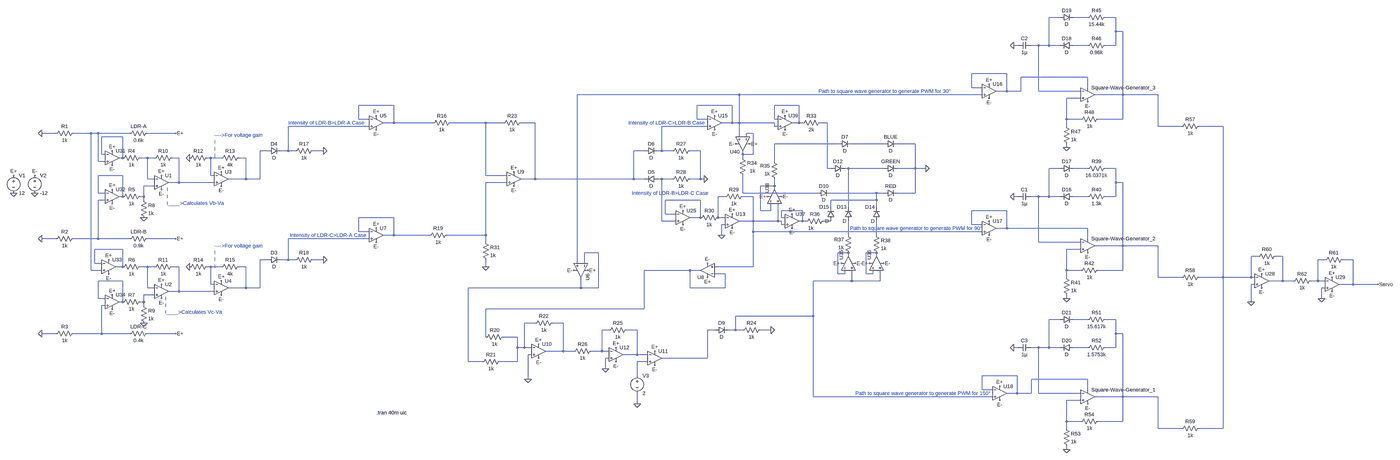
[diagram p0: schematic EE213_YunusCay_RafetKavak_CircuitSchematic.asc, whole sheet]
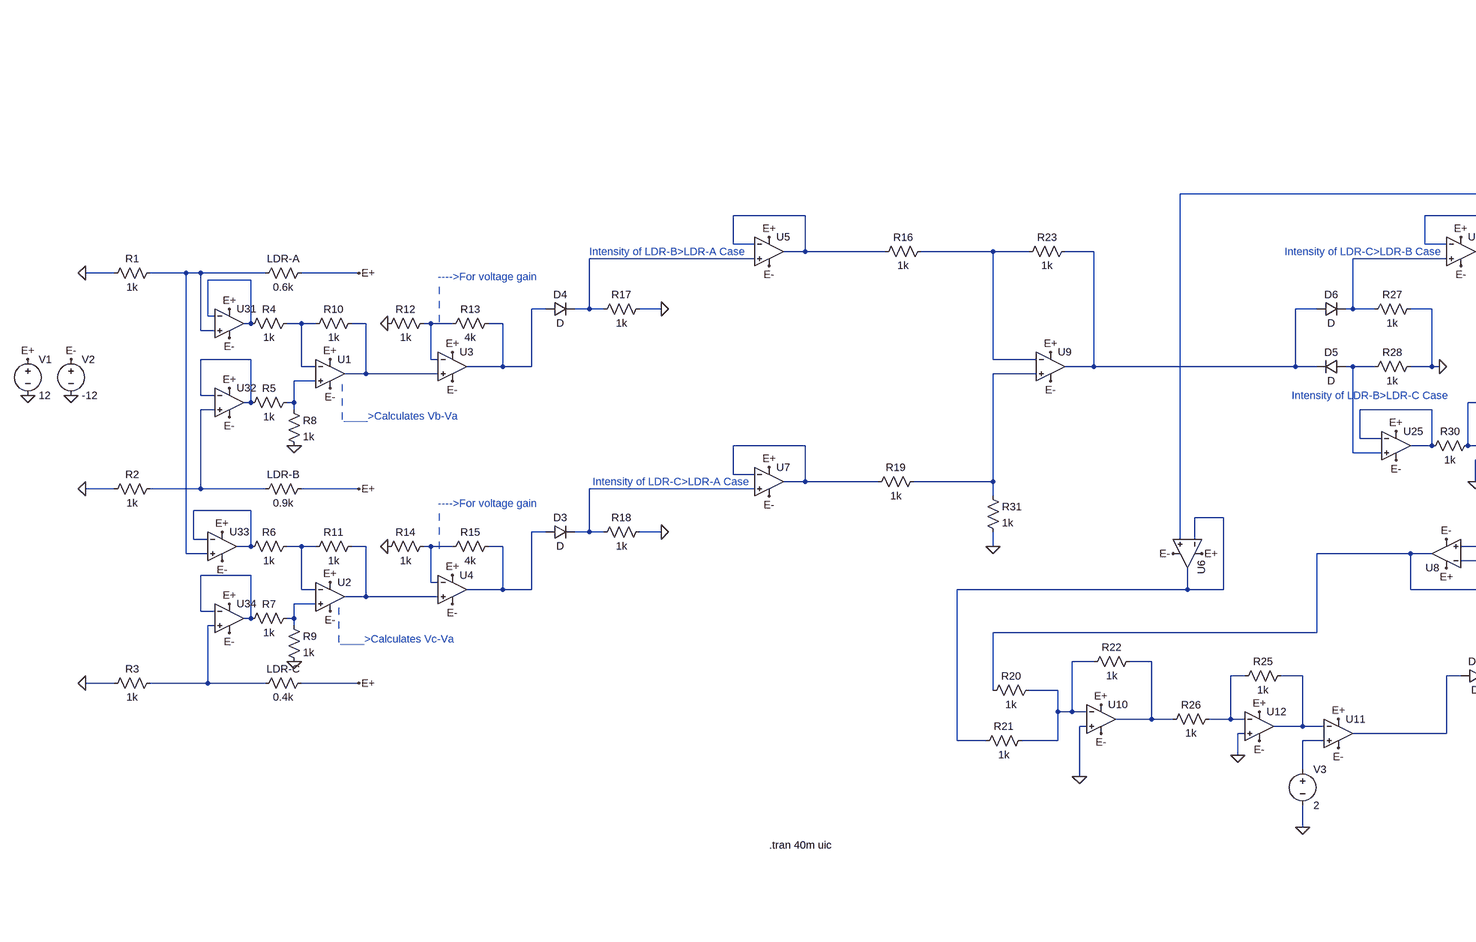
[diagram p1: schematic EE213_YunusCay_RafetKavak_CircuitSchematic.asc, part, row 1 of 1, column 1 of 2]
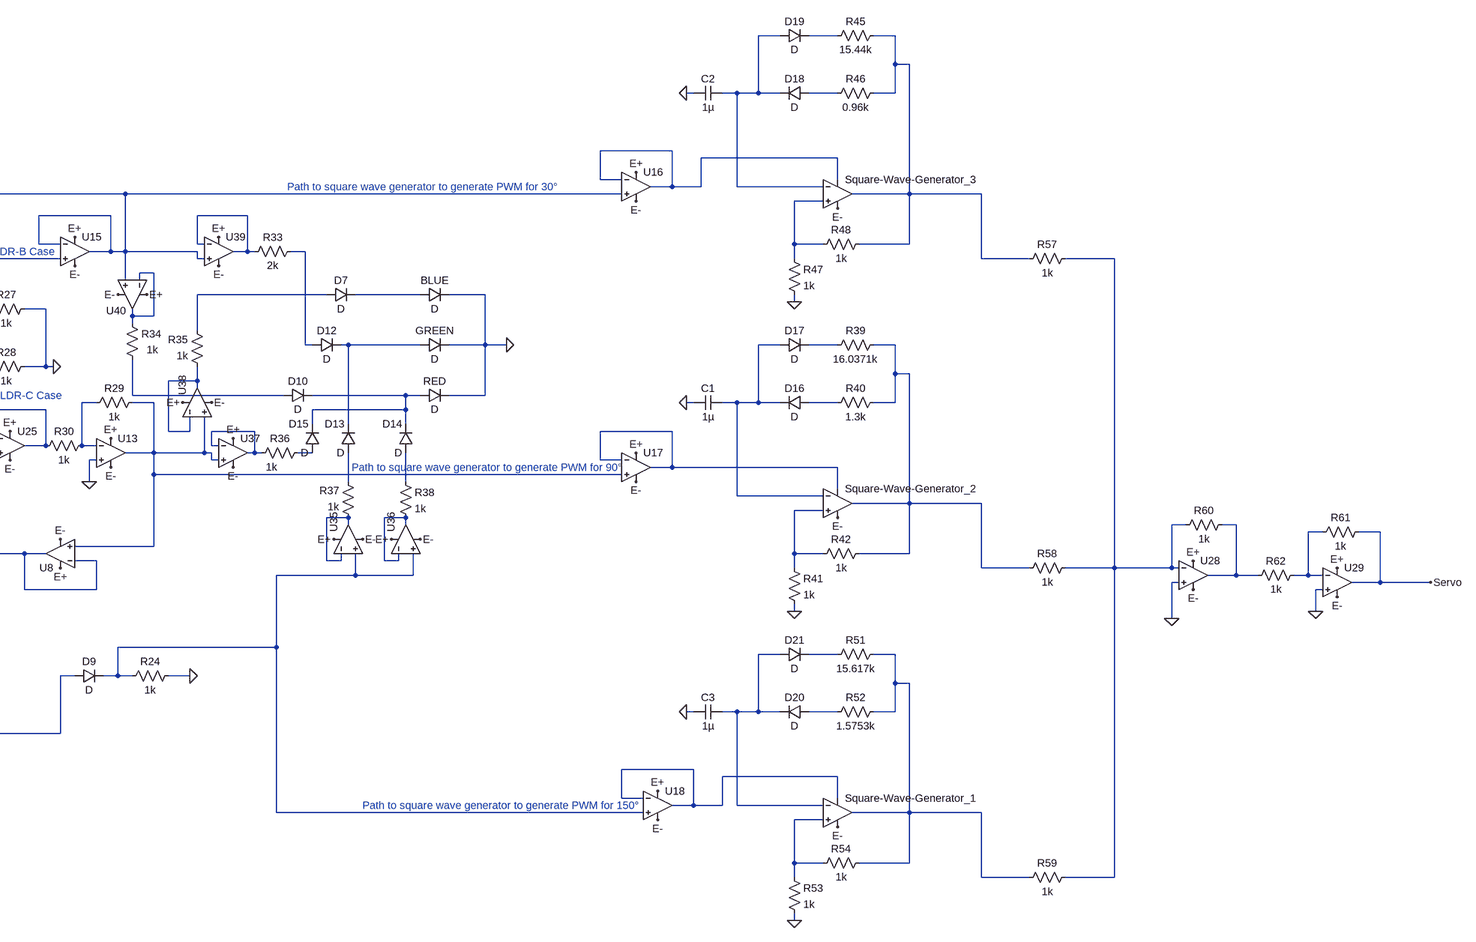
[diagram p2: schematic EE213_YunusCay_RafetKavak_CircuitSchematic.asc, part, row 1 of 1, column 2 of 2]
EE213_YunusCay_RafetKavak_CircuitSchematic.asc, the LTspice schematic file:
Version 4
SHEET 1 5364 1720
WIRE 1184 -288 1136 -288
WIRE 1312 -288 1248 -288
WIRE 1440 -288 1392 -288
WIRE 1440 -224 1440 -288
WIRE 1472 -224 1440 -224
WIRE 992 -160 976 -160
WIRE 1088 -160 1056 -160
WIRE 1136 -160 1136 -288
WIRE 1136 -160 1088 -160
WIRE 1184 -160 1136 -160
WIRE 1312 -160 1248 -160
WIRE 1440 -160 1440 -224
WIRE 1440 -160 1392 -160
WIRE 944 -32 784 -32
WIRE 1312 -16 1008 -16
WIRE 784 32 784 -32
WIRE 832 32 784 32
WIRE 1312 32 1312 -16
WIRE 944 48 944 -32
WIRE 944 48 896 48
WIRE 1008 48 1008 -16
WIRE 1008 48 944 48
WIRE 1088 48 1088 -160
WIRE 1280 48 1088 48
WIRE -272 64 -1008 64
WIRE 832 64 -272 64
WIRE 1472 64 1472 -224
WIRE 1472 64 1344 64
WIRE 1632 64 1472 64
WIRE 1280 80 1216 80
WIRE -1872 112 -2032 112
WIRE -304 112 -464 112
WIRE 0 112 -112 112
WIRE -2032 176 -2032 112
WIRE -1984 176 -2032 176
WIRE -464 176 -464 112
WIRE -416 176 -464 176
WIRE -112 176 -112 112
WIRE -96 176 -112 176
WIRE 1216 176 1216 80
WIRE 1280 176 1216 176
WIRE 1472 176 1472 64
WIRE 1472 176 1360 176
WIRE -1872 192 -1872 112
WIRE -1872 192 -1920 192
WIRE -1664 192 -1872 192
WIRE -1424 192 -1584 192
WIRE -1344 192 -1424 192
WIRE -1200 192 -1264 192
WIRE -304 192 -304 112
WIRE -304 192 -352 192
WIRE -272 192 -272 64
WIRE -272 192 -304 192
WIRE -112 192 -272 192
WIRE 0 192 0 112
WIRE 0 192 -32 192
WIRE 16 192 0 192
WIRE 128 192 96 192
WIRE -1984 208 -2352 208
WIRE -416 208 -624 208
WIRE -112 208 -112 192
WIRE -96 208 -112 208
WIRE 1216 208 1216 176
WIRE 1632 208 1632 64
WIRE 2240 208 1632 208
WIRE 2544 208 2320 208
WIRE -3408 240 -3472 240
WIRE -3248 240 -3328 240
WIRE -3216 240 -3248 240
WIRE -3072 240 -3216 240
WIRE -2864 240 -2992 240
WIRE -208 240 -240 240
WIRE -3104 256 -3200 256
WIRE -272 256 -272 192
WIRE -240 256 -240 240
WIRE 176 288 -112 288
WIRE 384 288 240 288
WIRE 528 288 448 288
WIRE 1216 304 1216 288
WIRE -2448 320 -2480 320
WIRE -2352 320 -2352 208
WIRE -2352 320 -2384 320
WIRE -2320 320 -2352 320
WIRE -2192 320 -2240 320
WIRE -704 320 -752 320
WIRE -624 320 -624 208
WIRE -624 320 -640 320
WIRE -576 320 -624 320
WIRE -448 320 -496 320
WIRE -3200 336 -3200 256
WIRE -3184 336 -3200 336
WIRE -256 336 -256 320
WIRE -208 336 -208 240
WIRE -208 336 -256 336
WIRE -3104 352 -3104 256
WIRE -3104 352 -3120 352
WIRE -2992 352 -3024 352
WIRE -2960 352 -2992 352
WIRE -2848 352 -2880 352
WIRE -2704 352 -2720 352
WIRE -2656 352 -2704 352
WIRE -2544 352 -2576 352
WIRE -256 352 -256 336
WIRE -3216 368 -3216 240
WIRE -3184 368 -3216 368
WIRE -112 368 -112 288
WIRE 128 400 128 192
WIRE 144 400 128 400
WIRE 224 400 208 400
WIRE 384 400 224 400
WIRE 528 400 528 288
WIRE 528 400 448 400
WIRE 576 400 528 400
WIRE 1184 400 1136 400
WIRE 1312 400 1248 400
WIRE 1440 400 1392 400
WIRE -3104 432 -3216 432
WIRE -2704 432 -2704 352
WIRE -2688 432 -2704 432
WIRE -1424 432 -1424 192
WIRE -1328 432 -1424 432
WIRE -2992 448 -2992 352
WIRE -2960 448 -2992 448
WIRE -2544 448 -2544 352
WIRE -2544 448 -2624 448
WIRE -2480 448 -2480 320
WIRE -2480 448 -2544 448
WIRE -1200 448 -1200 192
WIRE -1200 448 -1264 448
WIRE -752 448 -752 320
WIRE -752 448 -1200 448
WIRE -704 448 -752 448
WIRE -624 448 -640 448
WIRE -576 448 -624 448
WIRE -448 448 -448 320
WIRE -448 448 -496 448
WIRE -432 448 -448 448
WIRE -2848 464 -2848 352
WIRE -2848 464 -2896 464
WIRE -2688 464 -2848 464
WIRE -1328 464 -1424 464
WIRE 1440 464 1440 400
WIRE 1472 464 1440 464
WIRE -2960 480 -3008 480
WIRE -112 480 -112 448
WIRE -112 480 -176 480
WIRE -112 496 -112 480
WIRE -3216 512 -3216 432
WIRE -3184 512 -3216 512
WIRE -256 512 -256 432
WIRE 80 512 -256 512
WIRE 352 512 144 512
WIRE 384 512 352 512
WIRE 528 512 528 400
WIRE 528 512 448 512
WIRE -3104 528 -3104 432
WIRE -3104 528 -3120 528
WIRE -3008 528 -3008 480
WIRE -3008 528 -3024 528
WIRE -336 528 -368 528
WIRE -208 528 -256 528
WIRE 992 528 976 528
WIRE 1088 528 1056 528
WIRE 1136 528 1136 400
WIRE 1136 528 1088 528
WIRE 1184 528 1136 528
WIRE 1312 528 1248 528
WIRE 1440 528 1440 464
WIRE 1440 528 1392 528
WIRE -3184 544 -3216 544
WIRE -3008 544 -3008 528
WIRE -448 544 -608 544
WIRE 352 544 352 512
WIRE 352 544 144 544
WIRE 144 576 144 544
WIRE 224 576 224 400
WIRE 352 576 352 544
WIRE -176 592 -176 480
WIRE -128 592 -128 560
WIRE -128 592 -176 592
WIRE 16 592 -80 592
WIRE 944 592 784 592
WIRE -608 608 -608 544
WIRE -560 608 -608 608
WIRE -1872 624 -2032 624
WIRE -448 624 -448 544
WIRE -448 624 -496 624
WIRE -368 624 -368 528
WIRE -336 624 -368 624
WIRE -80 624 -80 592
WIRE -64 624 -80 624
WIRE -624 640 -624 448
WIRE -560 640 -624 640
WIRE -208 640 -208 528
WIRE -208 640 -272 640
WIRE -96 640 -96 560
WIRE -96 640 -208 640
WIRE -80 640 -96 640
WIRE 16 640 16 592
WIRE 16 640 0 640
WIRE 32 640 16 640
WIRE 144 640 112 640
WIRE -336 656 -352 656
WIRE -80 656 -80 640
WIRE -64 656 -80 656
WIRE 784 656 784 592
WIRE 832 656 784 656
WIRE 944 672 944 592
WIRE 944 672 896 672
WIRE 1312 672 944 672
WIRE -2032 688 -2032 624
WIRE -1984 688 -2032 688
WIRE -208 688 -208 640
WIRE 832 688 -208 688
WIRE -1872 704 -1872 624
WIRE -1872 704 -1920 704
WIRE -1680 704 -1872 704
WIRE -1424 704 -1424 464
WIRE -1424 704 -1600 704
WIRE -352 704 -352 656
WIRE 224 704 224 640
WIRE 352 704 352 640
WIRE -3408 720 -3472 720
WIRE -3216 720 -3216 544
WIRE -3216 720 -3328 720
WIRE -3072 720 -3216 720
WIRE -2864 720 -2992 720
WIRE -1984 720 -2352 720
WIRE 1312 720 1312 672
WIRE -1424 736 -1424 704
WIRE 1088 736 1088 528
WIRE 1280 736 1088 736
WIRE 1472 752 1472 464
WIRE 1472 752 1344 752
WIRE 1632 752 1472 752
WIRE -3104 768 -3232 768
WIRE 1280 768 1216 768
WIRE -912 784 -976 784
WIRE 224 784 176 784
WIRE 352 784 304 784
WIRE 224 800 224 784
WIRE 352 800 352 784
WIRE 2800 800 2768 800
WIRE 2912 800 2880 800
WIRE -2448 816 -2480 816
WIRE -2352 816 -2352 720
WIRE -2352 816 -2384 816
WIRE -2320 816 -2352 816
WIRE -2192 816 -2240 816
WIRE 3104 816 3072 816
WIRE 3232 816 3184 816
WIRE -3232 832 -3232 768
WIRE -3200 832 -3232 832
WIRE -1008 832 -1008 64
WIRE -976 832 -976 784
WIRE -3104 848 -3104 768
WIRE -3104 848 -3136 848
WIRE -2992 848 -3024 848
WIRE -2960 848 -2992 848
WIRE -2848 848 -2880 848
WIRE -2704 848 -2720 848
WIRE -2656 848 -2704 848
WIRE -2544 848 -2576 848
WIRE -1424 848 -1424 816
WIRE -208 848 -208 688
WIRE -208 848 -384 848
WIRE -3248 864 -3248 240
WIRE -3200 864 -3248 864
WIRE -496 864 -704 864
WIRE -448 864 -496 864
WIRE 1216 864 1216 768
WIRE 1280 864 1216 864
WIRE 1472 864 1472 752
WIRE 1472 864 1360 864
WIRE -336 880 -384 880
WIRE 176 880 176 784
WIRE 208 880 208 864
WIRE 208 880 176 880
WIRE 304 880 304 784
WIRE 336 880 336 864
WIRE 336 880 304 880
WIRE 1216 896 1216 864
WIRE 1632 896 1632 752
WIRE 2240 896 1632 896
WIRE 2544 896 2544 208
WIRE 2544 896 2320 896
WIRE 2768 896 2768 800
WIRE 2768 896 2544 896
WIRE 2784 896 2768 896
WIRE -3104 912 -3216 912
WIRE 240 912 240 864
WIRE 240 912 64 912
WIRE 368 912 368 864
WIRE 368 912 240 912
WIRE 2912 912 2912 800
WIRE 2912 912 2848 912
WIRE 2960 912 2912 912
WIRE 3072 912 3072 816
WIRE 3072 912 3040 912
WIRE 3104 912 3072 912
WIRE -2704 928 -2704 848
WIRE -2688 928 -2704 928
WIRE 2784 928 2768 928
WIRE 3232 928 3232 816
WIRE 3232 928 3168 928
WIRE 3392 928 3232 928
WIRE -2992 944 -2992 848
WIRE -2960 944 -2992 944
WIRE -2544 944 -2544 848
WIRE -2544 944 -2624 944
WIRE -2480 944 -2480 816
WIRE -2480 944 -2544 944
WIRE -992 944 -992 896
WIRE -992 944 -1504 944
WIRE -912 944 -912 784
WIRE -912 944 -992 944
WIRE -496 944 -496 864
WIRE -336 944 -336 880
WIRE -336 944 -496 944
WIRE 3104 944 3088 944
WIRE -2848 960 -2848 848
WIRE -2848 960 -2896 960
WIRE -2688 960 -2848 960
WIRE -2960 976 -3008 976
WIRE -3216 992 -3216 912
WIRE -3184 992 -3216 992
WIRE 1216 992 1216 976
WIRE 3088 992 3088 944
WIRE -3104 1008 -3104 912
WIRE -3104 1008 -3120 1008
WIRE -3008 1008 -3008 976
WIRE -3008 1008 -3024 1008
WIRE 2768 1008 2768 928
WIRE -3184 1024 -3200 1024
WIRE -3008 1024 -3008 1008
WIRE -704 1040 -704 864
WIRE -704 1040 -1424 1040
WIRE 64 1072 64 912
WIRE 64 1072 -288 1072
WIRE 1184 1088 1136 1088
WIRE 1312 1088 1248 1088
WIRE 1440 1088 1392 1088
WIRE -1200 1104 -1248 1104
WIRE -1072 1104 -1120 1104
WIRE -864 1136 -896 1136
WIRE -736 1136 -784 1136
WIRE -384 1136 -416 1136
WIRE -288 1136 -288 1072
WIRE -288 1136 -320 1136
WIRE -256 1136 -288 1136
WIRE -128 1136 -176 1136
WIRE -3408 1152 -3472 1152
WIRE -3200 1152 -3200 1024
WIRE -3200 1152 -3328 1152
WIRE -3072 1152 -3200 1152
WIRE -2864 1152 -2992 1152
WIRE 1440 1152 1440 1088
WIRE 1472 1152 1440 1152
WIRE -1424 1168 -1424 1040
WIRE -1280 1168 -1344 1168
WIRE -1280 1216 -1280 1168
WIRE -1248 1216 -1248 1104
WIRE -1248 1216 -1280 1216
WIRE -1216 1216 -1248 1216
WIRE 992 1216 976 1216
WIRE 1088 1216 1056 1216
WIRE 1136 1216 1136 1088
WIRE 1136 1216 1088 1216
WIRE 1184 1216 1136 1216
WIRE 1312 1216 1248 1216
WIRE 1440 1216 1440 1152
WIRE 1440 1216 1392 1216
WIRE -1072 1232 -1072 1104
WIRE -1072 1232 -1152 1232
WIRE -1024 1232 -1072 1232
WIRE -896 1232 -896 1136
WIRE -896 1232 -944 1232
WIRE -864 1232 -896 1232
WIRE -1216 1248 -1232 1248
WIRE -736 1248 -736 1136
WIRE -736 1248 -800 1248
WIRE -688 1248 -736 1248
WIRE -864 1264 -880 1264
WIRE -416 1264 -416 1136
WIRE -416 1264 -624 1264
WIRE -1504 1280 -1504 944
WIRE -1440 1280 -1504 1280
WIRE -1280 1280 -1280 1216
WIRE -1280 1280 -1360 1280
WIRE -688 1280 -736 1280
WIRE -880 1312 -880 1264
WIRE -736 1344 -736 1280
WIRE 992 1344 832 1344
WIRE -1232 1360 -1232 1248
WIRE 1312 1360 1056 1360
WIRE 832 1408 832 1344
WIRE 880 1408 832 1408
WIRE 1312 1408 1312 1360
WIRE 992 1424 992 1344
WIRE 992 1424 944 1424
WIRE 1056 1424 1056 1360
WIRE 1056 1424 992 1424
WIRE 1088 1424 1088 1216
WIRE 1280 1424 1088 1424
WIRE 64 1440 64 1072
WIRE 880 1440 64 1440
WIRE 1472 1440 1472 1152
WIRE 1472 1440 1344 1440
WIRE 1632 1440 1472 1440
WIRE 1280 1456 1216 1456
WIRE -736 1472 -736 1424
WIRE 1216 1552 1216 1456
WIRE 1280 1552 1216 1552
WIRE 1472 1552 1472 1440
WIRE 1472 1552 1360 1552
WIRE 1216 1584 1216 1552
WIRE 1632 1584 1632 1440
WIRE 2240 1584 1632 1584
WIRE 2544 1584 2544 896
WIRE 2544 1584 2320 1584
WIRE 1216 1680 1216 1664
FLAG -3472 240 0
FLAG -3472 720 0
FLAG -3472 1152 0
FLAG -3600 512 0
FLAG -3504 512 0
FLAG -3600 432 E+
FLAG -3504 432 E-
FLAG -3008 624 0
FLAG -3008 1104 0
FLAG -2800 352 0
FLAG -2800 848 0
FLAG -2192 320 0
FLAG -2192 816 0
FLAG -352 704 0
FLAG -432 448 0
FLAG 576 400 0
FLAG 976 528 0
FLAG 1216 992 0
FLAG 976 -160 0
FLAG 1216 304 0
FLAG 976 1216 0
FLAG 1216 1680 0
FLAG 2768 1008 0
FLAG 3088 992 0
FLAG -2928 432 E+
FLAG -2656 416 E+
FLAG -2928 928 E+
FLAG -2656 912 E+
FLAG -1952 672 E+
FLAG -1952 160 E+
FLAG -1296 416 E+
FLAG -304 608 E+
FLAG -384 160 E+
FLAG 864 16 E+
FLAG 864 640 E+
FLAG 912 1392 E+
FLAG 3136 896 E+
FLAG 2816 880 E+
FLAG 3136 960 E-
FLAG 2816 944 E-
FLAG 912 1456 E-
FLAG 864 704 E-
FLAG 864 80 E-
FLAG -304 672 E-
FLAG -384 224 E-
FLAG -1296 480 E-
FLAG -1952 736 E-
FLAG -1952 224 E-
FLAG -2656 480 E-
FLAG -2928 496 E-
FLAG -2656 976 E-
FLAG -2928 992 E-
FLAG -2864 240 E+
FLAG -2864 720 E+
FLAG -2864 1152 E+
FLAG 3392 928 Servo
FLAG -528 592 E+
FLAG -528 656 E-
FLAG -64 160 E+
FLAG -224 288 E+
FLAG -144 528 E+
FLAG -32 608 E+
FLAG 320 832 E+
FLAG 192 832 E+
FLAG -288 288 E-
FLAG -32 672 E-
FLAG -80 528 E-
FLAG -64 224 E-
FLAG 256 832 E-
FLAG 384 832 E-
FLAG -3152 320 E+
FLAG -3152 496 E+
FLAG -3168 816 E+
FLAG -3152 976 E+
FLAG -3152 384 E-
FLAG -3152 560 E-
FLAG -3168 880 E-
FLAG -3152 1040 E-
FLAG -960 864 E+
FLAG -1024 864 E-
FLAG -416 896 E+
FLAG -416 832 E-
FLAG -1184 1200 E+
FLAG -1184 1264 E-
FLAG -1232 1360 0
FLAG -128 1136 0
FLAG -656 1232 E+
FLAG -656 1296 E-
FLAG -736 1472 0
FLAG -880 1312 0
FLAG -832 1216 E+
FLAG -832 1280 E-
FLAG -1424 848 0
FLAG 1312 96 E-
FLAG 1312 784 E-
FLAG 1312 1472 E-
SYMBOL res -3312 224 R90
WINDOW 0 0 56 VBottom 2
WINDOW 3 32 56 VTop 2
SYMATTR InstName R1
SYMATTR Value 1k
SYMBOL res -3312 704 R90
WINDOW 0 0 56 VBottom 2
WINDOW 3 32 56 VTop 2
SYMATTR InstName R2
SYMATTR Value 1k
SYMBOL res -3312 1136 R90
WINDOW 0 0 56 VBottom 2
WINDOW 3 32 56 VTop 2
SYMATTR InstName R3
SYMATTR Value 1k
SYMBOL voltage -3600 416 R0
WINDOW 123 0 0 Left 2
WINDOW 39 0 0 Left 2
SYMATTR InstName V1
SYMATTR Value 12
SYMBOL voltage -3504 416 R0
WINDOW 123 0 0 Left 2
WINDOW 39 0 0 Left 2
SYMATTR InstName V2
SYMATTR Value -12
SYMBOL res -3008 336 R90
WINDOW 0 0 56 VBottom 2
WINDOW 3 32 56 VTop 2
SYMATTR InstName R4
SYMATTR Value 1k
SYMBOL res -3008 512 R90
WINDOW 0 0 56 VBottom 2
WINDOW 3 32 56 VTop 2
SYMATTR InstName R5
SYMATTR Value 1k
SYMBOL res -3008 832 R90
WINDOW 0 0 56 VBottom 2
WINDOW 3 32 56 VTop 2
SYMATTR InstName R6
SYMATTR Value 1k
SYMBOL res -3008 992 R90
WINDOW 0 0 56 VBottom 2
WINDOW 3 32 56 VTop 2
SYMATTR InstName R7
SYMATTR Value 1k
SYMBOL res -3024 528 R0
SYMATTR InstName R8
SYMATTR Value 1k
SYMBOL res -3024 1008 R0
SYMATTR InstName R9
SYMATTR Value 1k
SYMBOL res -2864 336 R90
WINDOW 0 0 56 VBottom 2
WINDOW 3 32 56 VTop 2
SYMATTR InstName R10
SYMATTR Value 1k
SYMBOL res -2864 832 R90
WINDOW 0 0 56 VBottom 2
WINDOW 3 32 56 VTop 2
SYMATTR InstName R11
SYMATTR Value 1k
SYMBOL Opamps\\UniversalOpamp2 -2928 464 R0
SYMATTR InstName U1
SYMBOL Opamps\\UniversalOpamp2 -2928 960 R0
SYMATTR InstName U2
SYMBOL Opamps\\UniversalOpamp2 -2656 448 R0
SYMATTR InstName U3
SYMBOL Opamps\\UniversalOpamp2 -2656 944 R0
SYMATTR InstName U4
SYMBOL res -2704 336 R90
WINDOW 0 0 56 VBottom 2
WINDOW 3 32 56 VTop 2
SYMATTR InstName R12
SYMATTR Value 1k
SYMBOL res -2560 336 R90
WINDOW 0 0 56 VBottom 2
WINDOW 3 32 56 VTop 2
SYMATTR InstName R13
SYMATTR Value 4k
SYMBOL res -2704 832 R90
WINDOW 0 0 56 VBottom 2
WINDOW 3 32 56 VTop 2
SYMATTR InstName R14
SYMATTR Value 1k
SYMBOL res -2560 832 R90
WINDOW 0 0 56 VBottom 2
WINDOW 3 32 56 VTop 2
SYMATTR InstName R15
SYMATTR Value 4k
SYMBOL diode -2448 832 R270
WINDOW 0 32 32 VTop 2
WINDOW 3 0 32 VBottom 2
SYMATTR InstName D3
SYMBOL diode -2448 336 R270
WINDOW 0 32 32 VTop 2
WINDOW 3 0 32 VBottom 2
SYMATTR InstName D4
SYMBOL res -2224 304 R90
WINDOW 0 0 56 VBottom 2
WINDOW 3 32 56 VTop 2
SYMATTR InstName R17
SYMATTR Value 1k
SYMBOL res -2224 800 R90
WINDOW 0 0 56 VBottom 2
WINDOW 3 32 56 VTop 2
SYMATTR InstName R18
SYMATTR Value 1k
SYMBOL Opamps\\UniversalOpamp2 -1952 192 R0
SYMATTR InstName U5
SYMBOL Opamps\\UniversalOpamp2 -1952 704 R0
SYMATTR InstName U7
SYMBOL Opamps\\UniversalOpamp2 -1296 448 R0
SYMATTR InstName U9
SYMBOL diode -640 432 R90
WINDOW 0 0 32 VBottom 2
WINDOW 3 32 32 VTop 2
SYMATTR InstName D5
SYMBOL diode -704 336 R270
WINDOW 0 32 32 VTop 2
WINDOW 3 0 32 VBottom 2
SYMATTR InstName D6
SYMBOL res -592 336 R270
WINDOW 0 32 56 VTop 2
WINDOW 3 0 56 VBottom 2
SYMATTR InstName R27
SYMATTR Value 1k
SYMBOL res -592 464 R270
WINDOW 0 32 56 VTop 2
WINDOW 3 0 56 VBottom 2
SYMATTR InstName R28
SYMATTR Value 1k
SYMBOL Opamps\\UniversalOpamp2 -304 640 R0
SYMATTR InstName U13
SYMBOL res -240 512 R90
WINDOW 0 0 56 VBottom 2
WINDOW 3 32 56 VTop 2
SYMATTR InstName R29
SYMATTR Value 1k
SYMBOL res -352 608 R90
WINDOW 0 0 56 VBottom 2
WINDOW 3 32 56 VTop 2
SYMATTR InstName R30
SYMATTR Value 1k
SYMBOL Opamps\\UniversalOpamp2 -384 192 R0
SYMATTR InstName U15
SYMBOL diode 384 304 R270
WINDOW 0 32 32 VTop 2
WINDOW 3 0 32 VBottom 2
SYMATTR InstName BLUE
SYMBOL diode 384 416 R270
WINDOW 0 32 32 VTop 2
WINDOW 3 0 32 VBottom 2
SYMATTR InstName GREEN
SYMBOL diode 384 528 R270
WINDOW 0 32 32 VTop 2
WINDOW 3 0 32 VBottom 2
SYMATTR InstName RED
SYMBOL res 112 176 R90
WINDOW 0 0 56 VBottom 2
WINDOW 3 32 56 VTop 2
SYMATTR InstName R33
SYMATTR Value 2k
SYMBOL res -272 336 R0
WINDOW 3 48 75 Left 2
SYMATTR Value 1k
SYMATTR InstName R34
SYMBOL res -96 464 R180
WINDOW 0 36 76 Left 2
WINDOW 3 36 40 Left 2
SYMATTR InstName R35
SYMATTR Value 1k
SYMBOL res 128 624 R90
WINDOW 0 0 56 VBottom 2
WINDOW 3 32 74 VTop 2
SYMATTR InstName R36
SYMATTR Value 1k
SYMBOL res 240 800 R180
WINDOW 0 36 76 Left 2
WINDOW 3 36 40 Left 2
SYMATTR InstName R37
SYMATTR Value 1k
SYMBOL res 336 688 R0
SYMATTR InstName R38
SYMATTR Value 1k
SYMBOL diode 80 528 R270
WINDOW 0 32 32 VTop 2
WINDOW 3 0 32 VBottom 2
SYMATTR InstName D10
SYMBOL diode 144 416 R270
WINDOW 0 32 32 VTop 2
WINDOW 3 0 32 VBottom 2
SYMATTR InstName D12
SYMBOL diode 240 640 R180
WINDOW 0 24 64 Left 2
WINDOW 3 24 0 Left 2
SYMATTR InstName D13
SYMBOL diode 368 640 R180
WINDOW 0 24 64 Left 2
WINDOW 3 24 0 Left 2
SYMATTR InstName D14
SYMBOL diode 160 640 R180
WINDOW 0 24 64 Left 2
WINDOW 3 24 0 Left 2
SYMATTR InstName D15
SYMBOL Opamps\\UniversalOpamp2 864 48 R0
SYMATTR InstName U16
SYMBOL Opamps\\UniversalOpamp2 864 672 R0
SYMATTR InstName U17
SYMBOL Opamps\\UniversalOpamp2 912 1424 R0
SYMATTR InstName U18
SYMBOL Opamps\\UniversalOpamp2 1312 1440 R0
SYMATTR InstName Square-Wave-Generator_1
SYMBOL cap 1056 512 R90
WINDOW 0 0 32 VBottom 2
WINDOW 3 32 32 VTop 2
SYMATTR InstName C1
SYMATTR Value 1µ
SYMBOL diode 1248 512 R90
WINDOW 0 0 32 VBottom 2
WINDOW 3 32 32 VTop 2
SYMATTR InstName D16
SYMBOL diode 1184 416 R270
WINDOW 0 32 32 VTop 2
WINDOW 3 0 32 VBottom 2
SYMATTR InstName D17
SYMBOL res 1296 416 R270
WINDOW 0 32 56 VTop 2
WINDOW 3 0 56 VBottom 2
SYMATTR InstName R39
SYMATTR Value 16.0371k
SYMBOL res 1296 544 R270
WINDOW 0 32 56 VTop 2
WINDOW 3 0 56 VBottom 2
SYMATTR InstName R40
SYMATTR Value 1.3k
SYMBOL res 1200 880 R0
SYMATTR InstName R41
SYMATTR Value 1k
SYMBOL res 1376 848 R90
WINDOW 0 0 56 VBottom 2
WINDOW 3 32 56 VTop 2
SYMATTR InstName R42
SYMATTR Value 1k
SYMBOL Opamps\\UniversalOpamp2 1312 752 R0
SYMATTR InstName Square-Wave-Generator_2
SYMBOL cap 1056 -176 R90
WINDOW 0 0 32 VBottom 2
WINDOW 3 32 32 VTop 2
SYMATTR InstName C2
SYMATTR Value 1µ
SYMBOL diode 1248 -176 R90
WINDOW 0 0 32 VBottom 2
WINDOW 3 32 32 VTop 2
SYMATTR InstName D18
SYMBOL diode 1184 -272 R270
WINDOW 0 32 32 VTop 2
WINDOW 3 0 32 VBottom 2
SYMATTR InstName D19
SYMBOL res 1296 -272 R270
WINDOW 0 32 56 VTop 2
WINDOW 3 0 56 VBottom 2
SYMATTR InstName R45
SYMATTR Value 15.44k
SYMBOL res 1296 -144 R270
WINDOW 0 32 56 VTop 2
WINDOW 3 0 56 VBottom 2
SYMATTR InstName R46
SYMATTR Value 0.96k
SYMBOL res 1200 192 R0
SYMATTR InstName R47
SYMATTR Value 1k
SYMBOL res 1376 160 R90
WINDOW 0 0 56 VBottom 2
WINDOW 3 32 56 VTop 2
SYMATTR InstName R48
SYMATTR Value 1k
SYMBOL Opamps\\UniversalOpamp2 1312 64 R0
SYMATTR InstName Square-Wave-Generator_3
SYMBOL cap 1056 1200 R90
WINDOW 0 0 32 VBottom 2
WINDOW 3 32 32 VTop 2
SYMATTR InstName C3
SYMATTR Value 1µ
SYMBOL diode 1248 1200 R90
WINDOW 0 0 32 VBottom 2
WINDOW 3 32 32 VTop 2
SYMATTR InstName D20
SYMBOL diode 1184 1104 R270
WINDOW 0 32 32 VTop 2
WINDOW 3 0 32 VBottom 2
SYMATTR InstName D21
SYMBOL res 1296 1104 R270
WINDOW 0 32 56 VTop 2
WINDOW 3 0 56 VBottom 2
SYMATTR InstName R51
SYMATTR Value 15.617k
SYMBOL res 1296 1232 R270
WINDOW 0 32 56 VTop 2
WINDOW 3 0 56 VBottom 2
SYMATTR InstName R52
SYMATTR Value 1.5753k
SYMBOL res 1200 1568 R0
SYMATTR InstName R53
SYMATTR Value 1k
SYMBOL res 1376 1536 R90
WINDOW 0 0 56 VBottom 2
WINDOW 3 32 56 VTop 2
SYMATTR InstName R54
SYMATTR Value 1k
SYMBOL res 2336 192 R90
WINDOW 0 0 56 VBottom 2
WINDOW 3 32 56 VTop 2
SYMATTR InstName R57
SYMATTR Value 1k
SYMBOL res 2336 880 R90
WINDOW 0 0 56 VBottom 2
WINDOW 3 32 56 VTop 2
SYMATTR InstName R58
SYMATTR Value 1k
SYMBOL res 2336 1568 R90
WINDOW 0 0 56 VBottom 2
WINDOW 3 32 56 VTop 2
SYMATTR InstName R59
SYMATTR Value 1k
SYMBOL Opamps\\UniversalOpamp2 2816 912 R0
SYMATTR InstName U28
SYMBOL res 2896 784 R90
WINDOW 0 0 56 VBottom 2
WINDOW 3 32 56 VTop 2
SYMATTR InstName R60
SYMATTR Value 1k
SYMBOL Opamps\\UniversalOpamp2 3136 928 R0
SYMATTR InstName U29
SYMBOL res 3200 800 R90
WINDOW 0 0 56 VBottom 2
WINDOW 3 32 56 VTop 2
SYMATTR InstName R61
SYMATTR Value 1k
SYMBOL res 3056 896 R90
WINDOW 0 0 56 VBottom 2
WINDOW 3 32 56 VTop 2
SYMATTR InstName R62
SYMATTR Value 1k
SYMBOL res -2976 224 R90
WINDOW 0 0 56 VBottom 2
WINDOW 3 32 56 VTop 2
SYMATTR InstName LDR-A
SYMATTR Value 0.6k
SYMBOL res -2976 704 R90
WINDOW 0 0 56 VBottom 2
WINDOW 3 32 56 VTop 2
SYMATTR InstName LDR-B
SYMATTR Value 0.9k
SYMBOL res -2976 1136 R90
WINDOW 0 0 56 VBottom 2
WINDOW 3 32 56 VTop 2
SYMATTR InstName LDR-C
SYMATTR Value 0.4k
SYMBOL Opamps\\UniversalOpamp2 -528 624 R0
SYMATTR InstName U25
SYMBOL diode 176 304 R270
WINDOW 0 32 32 VTop 2
WINDOW 3 0 32 VBottom 2
SYMATTR InstName D7
SYMBOL Opamps\\UniversalOpamp2 -3152 528 R0
SYMATTR InstName U32
SYMBOL Opamps\\UniversalOpamp2 -3152 352 R0
SYMATTR InstName U31
SYMBOL Opamps\\UniversalOpamp2 -3168 848 R0
SYMATTR InstName U33
SYMBOL Opamps\\UniversalOpamp2 -3152 1008 R0
SYMATTR InstName U34
SYMBOL Opamps\\UniversalOpamp2 224 832 R270
SYMATTR InstName U35
SYMBOL Opamps\\UniversalOpamp2 352 832 R270
SYMATTR InstName U36
SYMBOL Opamps\\UniversalOpamp2 -32 640 R0
SYMATTR InstName U37
SYMBOL Opamps\\UniversalOpamp2 -112 528 R270
SYMATTR InstName U38
SYMBOL Opamps\\UniversalOpamp2 -64 192 R0
SYMATTR InstName U39
SYMBOL Opamps\\UniversalOpamp2 -256 288 R90
WINDOW 0 36 14 VRight 2
SYMATTR InstName U40
SYMBOL Opamps\\UniversalOpamp2 -992 864 R90
SYMATTR InstName U6
SYMBOL Opamps\\UniversalOpamp2 -416 864 R180
SYMATTR InstName U8
SYMBOL Opamps\\UniversalOpamp2 -1184 1232 R0
SYMATTR InstName U10
SYMBOL res -1328 1152 R90
WINDOW 0 0 56 VBottom 2
WINDOW 3 32 56 VTop 2
SYMATTR InstName R20
SYMATTR Value 1k
SYMBOL res -1344 1264 R90
WINDOW 0 0 56 VBottom 2
WINDOW 3 32 56 VTop 2
SYMATTR InstName R21
SYMATTR Value 1k
SYMBOL res -1104 1088 R90
WINDOW 0 0 56 VBottom 2
WINDOW 3 32 56 VTop 2
SYMATTR InstName R22
SYMATTR Value 1k
SYMBOL diode -384 1152 R270
WINDOW 0 32 32 VTop 2
WINDOW 3 0 32 VBottom 2
SYMATTR InstName D9
SYMBOL res -160 1120 R90
WINDOW 0 0 56 VBottom 2
WINDOW 3 32 56 VTop 2
SYMATTR InstName R24
SYMATTR Value 1k
SYMBOL Opamps\\UniversalOpamp2 -656 1264 R0
SYMATTR InstName U11
SYMBOL voltage -736 1328 R0
WINDOW 123 0 0 Left 2
WINDOW 39 0 0 Left 2
SYMATTR InstName V3
SYMATTR Value 2
SYMBOL Opamps\\UniversalOpamp2 -832 1248 R0
SYMATTR InstName U12
SYMBOL res -768 1120 R90
WINDOW 0 0 56 VBottom 2
WINDOW 3 32 56 VTop 2
SYMATTR InstName R25
SYMATTR Value 1k
SYMBOL res -928 1216 R90
WINDOW 0 0 56 VBottom 2
WINDOW 3 32 56 VTop 2
SYMATTR InstName R26
SYMATTR Value 1k
SYMBOL res -1568 176 R90
WINDOW 0 0 56 VBottom 2
WINDOW 3 32 56 VTop 2
SYMATTR InstName R16
SYMATTR Value 1k
SYMBOL res -1584 688 R90
WINDOW 0 0 56 VBottom 2
WINDOW 3 32 56 VTop 2
SYMATTR InstName R19
SYMATTR Value 1k
SYMBOL res -1248 176 R90
WINDOW 0 0 56 VBottom 2
WINDOW 3 32 56 VTop 2
SYMATTR InstName R23
SYMATTR Value 1k
SYMBOL res -1440 720 R0
SYMATTR InstName R31
SYMATTR Value 1k
TEXT -1952 1512 Left 2 !.tran 40m uic
TEXT -2352 192 Left 2 ;Intensity of LDR-B>LDR-A Case
TEXT -2344 704 Left 2 ;Intensity of LDR-C>LDR-A Case
TEXT -2904 496 Left 2 ;I\nI\nI____>Calculates Vb-Va
TEXT -2912 992 Left 2 ;I\nI\nI____>Calculates Vc-Va
TEXT -2688 248 Left 2 ;---->For voltage gain\nI\nI\nI
TEXT -2688 752 Left 2 ;---->For voltage gain\nI\nI\nI
TEXT -776 192 Left 2 ;Intensity of LDR-C>LDR-B Case
TEXT -760 512 Left 2 ;Intensity of LDR-B>LDR-C Case
TEXT 88 48 Left 2 ;Path to square wave generator to generate PWM for 30°
TEXT 232 672 Left 2 ;Path to square wave generator to generate PWM for 90°
TEXT 256 1424 Left 2 ;Path to square wave generator to generate PWM for 150°

The netlist it stands for:
* EE213_YunusCay_RafetKavak_CircuitSchematic.asc
R1 N016 0 1k
R2 N039 0 1k
R3 N063 0 1k
V1 E+ 0 12
V2 E- 0 -12
R4 N022 N018 1k
R5 N032 N029 1k
R6 N056 N048 1k
R7 N062 N060 1k
R8 N032 0 1k
R9 N062 0 1k
R10 N023 N022 1k
R11 N057 N056 1k
XU1 N032 N022 E+ E- N023 level.2 Avol=1Meg GBW=10Meg Slew=10Meg ilimit=25m rail=0 Vos=0 phimargin=45 en=0 enk=0 in=0 ink=0 Rin=500Meg  ; pins IN+ IN- V+ V- OUT
XU2 N062 N056 E+ E- N057 level.2 Avol=1Meg GBW=10Meg Slew=10Meg ilimit=25m rail=0 Vos=0 phimargin=45 en=0 enk=0 in=0 ink=0 Rin=500Meg  ; pins IN+ IN- V+ V- OUT
XU3 N023 N024 E+ E- N021 level.2 Avol=1Meg GBW=10Meg Slew=10Meg ilimit=25m rail=0 Vos=0 phimargin=45 en=0 enk=0 in=0 ink=0 Rin=500Meg  ; pins IN+ IN- V+ V- OUT
XU4 N057 N058 E+ E- N054 level.2 Avol=1Meg GBW=10Meg Slew=10Meg ilimit=25m rail=0 Vos=0 phimargin=45 en=0 enk=0 in=0 ink=0 Rin=500Meg  ; pins IN+ IN- V+ V- OUT
R12 N024 0 1k
R13 N021 N024 4k
R14 N058 0 1k
R15 N054 N058 4k
D3 N054 N047 D
D4 N021 N013 D
R17 0 N013 1k
R18 0 N047 1k
XU5 N013 N008 E+ E- N008 level.2 Avol=1Meg GBW=10Meg Slew=10Meg ilimit=25m rail=0 Vos=0 phimargin=45 en=0 enk=0 in=0 ink=0 Rin=500Meg  ; pins IN+ IN- V+ V- OUT
XU7 N047 N043 E+ E- N043 level.2 Avol=1Meg GBW=10Meg Slew=10Meg ilimit=25m rail=0 Vos=0 phimargin=45 en=0 enk=0 in=0 ink=0 Rin=500Meg  ; pins IN+ IN- V+ V- OUT
XU9 N031 N010 E+ E- N011 level.2 Avol=1Meg GBW=10Meg Slew=10Meg ilimit=25m rail=0 Vos=0 phimargin=45 en=0 enk=0 in=0 ink=0 Rin=500Meg  ; pins IN+ IN- V+ V- OUT
D5 N030 N011 D
D6 N011 N014 D
R27 N014 0 1k
R28 N030 0 1k
XU13 0 N036 E+ E- N037 level.2 Avol=1Meg GBW=10Meg Slew=10Meg ilimit=25m rail=0 Vos=0 phimargin=45 en=0 enk=0 in=0 ink=0 Rin=500Meg  ; pins IN+ IN- V+ V- OUT
R29 N037 N036 1k
R30 N036 N040 1k
XU15 N014 N006 E+ E- N006 level.2 Avol=1Meg GBW=10Meg Slew=10Meg ilimit=25m rail=0 Vos=0 phimargin=45 en=0 enk=0 in=0 ink=0 Rin=500Meg  ; pins IN+ IN- V+ V- OUT
D§BLUE N020 0 D
D§GREEN N025 0 D
D§RED N035 0 D
R33 N012 N009 2k
R34 N017 N034 1k
R35 N033 N019 1k
R36 N044 N041 1k
R37 N051 N045 1k
R38 N046 N052 1k
D10 N034 N035 D
D12 N012 N025 D
D13 N045 N025 D
D14 N046 N035 D
D15 N044 N035 D
XU16 N006 N005 E+ E- N005 level.2 Avol=1Meg GBW=10Meg Slew=10Meg ilimit=25m rail=0 Vos=0 phimargin=45 en=0 enk=0 in=0 ink=0 Rin=500Meg  ; pins IN+ IN- V+ V- OUT
XU17 N037 N042 E+ E- N042 level.2 Avol=1Meg GBW=10Meg Slew=10Meg ilimit=25m rail=0 Vos=0 phimargin=45 en=0 enk=0 in=0 ink=0 Rin=500Meg  ; pins IN+ IN- V+ V- OUT
XU18 N061 N074 E+ E- N074 level.2 Avol=1Meg GBW=10Meg Slew=10Meg ilimit=25m rail=0 Vos=0 phimargin=45 en=0 enk=0 in=0 ink=0 Rin=500Meg  ; pins IN+ IN- V+ V- OUT
XSquare-Wave-Generator_1 N075 N064 N074 E- N066 level.2 Avol=1Meg GBW=10Meg Slew=10Meg ilimit=25m rail=0 Vos=0 phimargin=45 en=0 enk=0 in=0 ink=0 Rin=500Meg  ; pins IN+ IN- V+ V- OUT
C1 N026 0 1µ
D16 N038 N026 D
D17 N026 N027 D
R39 N027 N028 16.0371k
R40 N038 N028 1.3k
R41 N049 0 1k
R42 N028 N049 1k
XSquare-Wave-Generator_2 N049 N026 N042 E- N028 level.2 Avol=1Meg GBW=10Meg Slew=10Meg ilimit=25m rail=0 Vos=0 phimargin=45 en=0 enk=0 in=0 ink=0 Rin=500Meg  ; pins IN+ IN- V+ V- OUT
C2 N001 0 1µ
D18 N004 N001 D
D19 N001 N002 D
R45 N002 N003 15.44k
R46 N004 N003 0.96k
R47 N007 0 1k
R48 N003 N007 1k
XSquare-Wave-Generator_3 N007 N001 N005 E- N003 level.2 Avol=1Meg GBW=10Meg Slew=10Meg ilimit=25m rail=0 Vos=0 phimargin=45 en=0 enk=0 in=0 ink=0 Rin=500Meg  ; pins IN+ IN- V+ V- OUT
C3 N064 0 1µ
D20 N072 N064 D
D21 N064 N065 D
R51 N065 N066 15.617k
R52 N072 N066 1.5753k
R53 N075 0 1k
R54 N066 N075 1k
R57 N015 N003 1k
R58 N015 N028 1k
R59 N015 N066 1k
XU28 0 N015 E+ E- N053 level.2 Avol=1Meg GBW=10Meg Slew=10Meg ilimit=25m rail=0 Vos=0 phimargin=45 en=0 enk=0 in=0 ink=0 Rin=500Meg  ; pins IN+ IN- V+ V- OUT
R60 N053 N015 1k
XU29 0 N055 E+ E- Servo level.2 Avol=1Meg GBW=10Meg Slew=10Meg ilimit=25m rail=0 Vos=0 phimargin=45 en=0 enk=0 in=0 ink=0 Rin=500Meg  ; pins IN+ IN- V+ V- OUT
R61 Servo N055 1k
R62 N055 N053 1k
R§LDR-A E+ N016 0.6k
R§LDR-B E+ N039 0.9k
R§LDR-C E+ N063 0.4k
XU25 N030 N040 E+ E- N040 level.2 Avol=1Meg GBW=10Meg Slew=10Meg ilimit=25m rail=0 Vos=0 phimargin=45 en=0 enk=0 in=0 ink=0 Rin=500Meg  ; pins IN+ IN- V+ V- OUT
D7 N019 N020 D
XU32 N039 N029 E+ E- N029 level.2 Avol=1Meg GBW=10Meg Slew=10Meg ilimit=25m rail=0 Vos=0 phimargin=45 en=0 enk=0 in=0 ink=0 Rin=500Meg  ; pins IN+ IN- V+ V- OUT
XU31 N016 N018 E+ E- N018 level.2 Avol=1Meg GBW=10Meg Slew=10Meg ilimit=25m rail=0 Vos=0 phimargin=45 en=0 enk=0 in=0 ink=0 Rin=500Meg  ; pins IN+ IN- V+ V- OUT
XU33 N016 N048 E+ E- N048 level.2 Avol=1Meg GBW=10Meg Slew=10Meg ilimit=25m rail=0 Vos=0 phimargin=45 en=0 enk=0 in=0 ink=0 Rin=500Meg  ; pins IN+ IN- V+ V- OUT
XU34 N063 N060 E+ E- N060 level.2 Avol=1Meg GBW=10Meg Slew=10Meg ilimit=25m rail=0 Vos=0 phimargin=45 en=0 enk=0 in=0 ink=0 Rin=500Meg  ; pins IN+ IN- V+ V- OUT
XU35 N061 N051 E+ E- N051 level.2 Avol=1Meg GBW=10Meg Slew=10Meg ilimit=25m rail=0 Vos=0 phimargin=45 en=0 enk=0 in=0 ink=0 Rin=500Meg  ; pins IN+ IN- V+ V- OUT
XU36 N061 N052 E+ E- N052 level.2 Avol=1Meg GBW=10Meg Slew=10Meg ilimit=25m rail=0 Vos=0 phimargin=45 en=0 enk=0 in=0 ink=0 Rin=500Meg  ; pins IN+ IN- V+ V- OUT
XU37 N037 N041 E+ E- N041 level.2 Avol=1Meg GBW=10Meg Slew=10Meg ilimit=25m rail=0 Vos=0 phimargin=45 en=0 enk=0 in=0 ink=0 Rin=500Meg  ; pins IN+ IN- V+ V- OUT
XU38 N037 N033 E+ E- N033 level.2 Avol=1Meg GBW=10Meg Slew=10Meg ilimit=25m rail=0 Vos=0 phimargin=45 en=0 enk=0 in=0 ink=0 Rin=500Meg  ; pins IN+ IN- V+ V- OUT
XU39 N006 N009 E+ E- N009 level.2 Avol=1Meg GBW=10Meg Slew=10Meg ilimit=25m rail=0 Vos=0 phimargin=45 en=0 enk=0 in=0 ink=0 Rin=500Meg  ; pins IN+ IN- V+ V- OUT
XU40 N006 N017 E+ E- N017 level.2 Avol=1Meg GBW=10Meg Slew=10Meg ilimit=25m rail=0 Vos=0 phimargin=45 en=0 enk=0 in=0 ink=0 Rin=500Meg  ; pins IN+ IN- V+ V- OUT
XU6 N006 N050 E+ E- N050 level.2 Avol=1Meg GBW=10Meg Slew=10Meg ilimit=25m rail=0 Vos=0 phimargin=45 en=0 enk=0 in=0 ink=0 Rin=500Meg  ; pins IN+ IN- V+ V- OUT
XU8 N037 N059 E+ E- N059 level.2 Avol=1Meg GBW=10Meg Slew=10Meg ilimit=25m rail=0 Vos=0 phimargin=45 en=0 enk=0 in=0 ink=0 Rin=500Meg  ; pins IN+ IN- V+ V- OUT
XU10 0 N067 E+ E- N068 level.2 Avol=1Meg GBW=10Meg Slew=10Meg ilimit=25m rail=0 Vos=0 phimargin=45 en=0 enk=0 in=0 ink=0 Rin=500Meg  ; pins IN+ IN- V+ V- OUT
R20 N067 N059 1k
R21 N067 N050 1k
R22 N068 N067 1k
D9 N071 N061 D
R24 0 N061 1k
XU11 N073 N070 E+ E- N071 level.2 Avol=1Meg GBW=10Meg Slew=10Meg ilimit=25m rail=0 Vos=0 phimargin=45 en=0 enk=0 in=0 ink=0 Rin=500Meg  ; pins IN+ IN- V+ V- OUT
V3 N073 0 2
XU12 0 N069 E+ E- N070 level.2 Avol=1Meg GBW=10Meg Slew=10Meg ilimit=25m rail=0 Vos=0 phimargin=45 en=0 enk=0 in=0 ink=0 Rin=500Meg  ; pins IN+ IN- V+ V- OUT
R25 N070 N069 1k
R26 N069 N068 1k
R16 N010 N008 1k
R19 N031 N043 1k
R23 N011 N010 1k
R31 N031 0 1k
.model D D
.lib standard.dio
.tran 40m uic
* Intensity of LDR-B>LDR-A Case
* Intensity of LDR-C>LDR-A Case
* I
* I
* I____>Calculates Vb-Va
* I
* I
* I____>Calculates Vc-Va
* ---->For voltage gain
* I
* I
* I
* ---->For voltage gain
* I
* I
* I
* Intensity of LDR-C>LDR-B Case
* Intensity of LDR-B>LDR-C Case
* Path to square wave generator to generate PWM for 30°
* Path to square wave generator to generate PWM for 90°
* Path to square wave generator to generate PWM for 150°
.lib UniversalOpamps2.sub
.backanno
.end